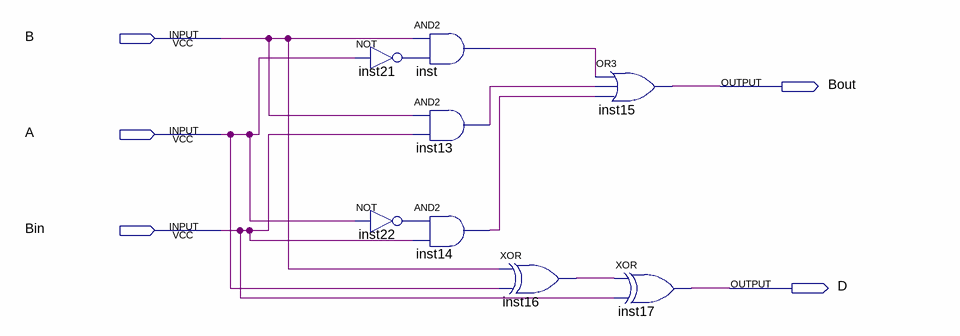
[diagram p0: schematic sheet]
// Quartus schematic subtrator.bdf as structural Verilog: 8 symbols, 5 pins
module subtrator (
  input  B,
  input  A,
  input  Bin,
  output Bout,
  output D
);

  wire inst13_out, inst14_out, inst16_out, inst21_out, inst22_out, inst_out;

  not inst21 (inst21_out, A);
  not inst22 (inst22_out, A);
  and inst (inst_out, B, inst21_out);
  and inst13 (inst13_out, B, Bin);
  and inst14 (inst14_out, inst22_out, Bin);
  xor inst16 (inst16_out, B, A);
  or inst15 (Bout, inst_out, inst13_out, inst14_out);
  xor inst17 (D, inst16_out, Bin);
endmodule
